# Altium schematic sheet sch-pi-radio-bonnet.SchDoc
size A4
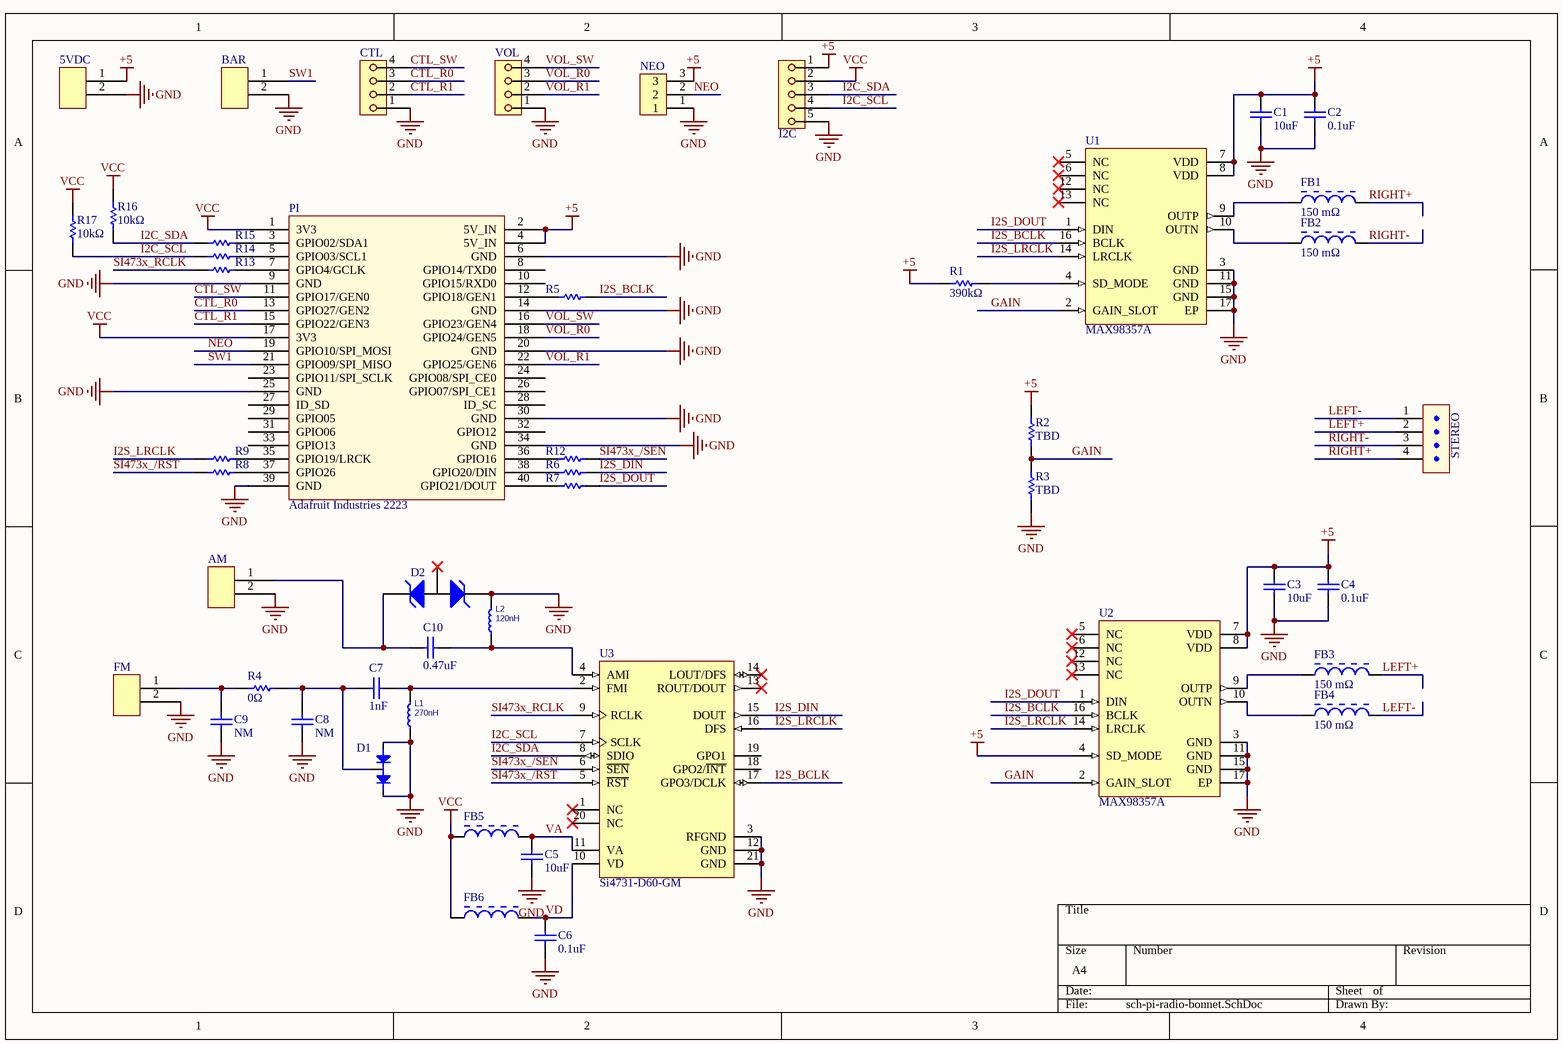
[diagram p0: sch-pi-radio-bonnet.SchDoc]

## Parts
5VDC  Barrette 2p  [PCB-ayp4uy6mce3kuznu7cpv-1]  (value not drawn)
AM  Barrette 2p  [PCB-ayp4uy6mce3kuznu7cpv-1]  (value not drawn)
BAR  Barrette 2p  [PCB-ayp4uy6mce3kuznu7cpv-1]  (value not drawn)
C1  10uF  [PCB-omhpi3dp2pmtm0tjiw77-1]
C2  0.1uF  [PCB-clu7e9t765a29ce8du29-1]
C3  10uF  [PCB-omhpi3dp2pmtm0tjiw77-1]
C4  0.1uF  [PCB-clu7e9t765a29ce8du29-1]
C5  10uF  [PCB-omhpi3dp2pmtm0tjiw77-1]
C6  0.1uF  [PCB-clu7e9t765a29ce8du29-1]
C7  1nF  [PCB-n0nn8wk56cuuomqd6cni-1]
C8  NM  [PCB-n0nn8wk56cuuomqd6cni-1]
C9  NM  [PCB-n0nn8wk56cuuomqd6cni-1]
C10  0.47uF  [PCB-7meup49cu6qw2zbjtc97-1]
CTL  Molex 90120-0764  [PCB-mruwntkvy73mrw75dg9m-1]  (value not drawn)
D1  BAV99LT1G  [ONSC-SOT-23-3-318-08_V]  (value not drawn)
D2  CM1214A-01SO  [ONSC-SOT-23-3-318-08_V]  (value not drawn)
FB1  150 mΩ  [MMZ1608B121C]
FB2  150 mΩ  [MMZ1608B121C]
FB3  150 mΩ  [MMZ1608B121C]
FB4  150 mΩ  [MMZ1608B121C]
FB5  BLM18BB331SN1D  [MURA-BLM18-RF-H4-CHIP-2_V]  (value not drawn)
FB6  BLM18BB331SN1D  [MURA-BLM18-RF-H4-CHIP-2_V]  (value not drawn)
FM  Barrette 2p  [PCB-ayp4uy6mce3kuznu7cpv-1]  (value not drawn)
I2C  Molex 90120-0765  [PCB-t56pkikz1yynik2i2jge-1]  (value not drawn)
L1  270nH  [PCB-2aq0h2ab72d503fsqzz9-1]
L2  120nH  [PCB-2aq0h2ab72d503fsqzz9-1]
NEO  TE Connectivity / AMP 4-103321-5  [PCB-xi9jnxfk0tsn3lp09zze-1]  (value not drawn)
PI  Adafruit Industries 2223  [PCB-dv9vmhrfa2chsb9gidwm-1]
R1  390kΩ  [PCB-cvo6ml1wdjffqaw6a973-1]
R2  TBD  [RESC1609X55X30LL10T20]
R3  TBD  [RESC1609X55X30LL10T20]
R4  0Ω  [RESC1609X55X30LL10T20]
R5  0Ω  [RESC1608X55X25LL10T15]  (value not drawn)
R6  0Ω  [RESC1608X55X25LL10T15]  (value not drawn)
R7  0Ω  [RESC1608X55X25LL10T15]  (value not drawn)
R8  0Ω  [RESC1608X55X25LL10T15]  (value not drawn)
R9  0Ω  [RESC1608X55X25LL10T15]  (value not drawn)
R12  0Ω  [RESC1608X55X25LL10T15]  (value not drawn)
R13  0Ω  [RESC1608X55X25LL10T15]  (value not drawn)
R14  0Ω  [RESC1608X55X25LL10T15]  (value not drawn)
R15  0Ω  [RESC1608X55X25LL10T15]  (value not drawn)
R16  10kΩ  [RESC1609X55X30LL10T20]
R17  10kΩ  [RESC1609X55X30LL10T20]
STEREO  B4B-PH-K-S(LF)(SN)  [PCB-nfo1v6t1kar7doke0b73-1]  (value not drawn)
U1  MAX98357A  [MAXM-T1633F+3_Mod]
U2  MAX98357A  [MAXM-T1633F+3_Mod]
U3  Si4731-D60-GM  [SLAB-QFN-20-1700x1700TP_V]
VOL  Molex 90120-0764  [PCB-mruwntkvy73mrw75dg9m-1]  (value not drawn)

## Nets
+5: 5VDC.1 C1.2 C2.2 C3.2 C4.2 I2C.1 NEO.3 PI.2(5V_IN) PI.4(5V_IN) R1.1 R2.1 U1.7(VDD) U1.8(VDD) U2.4(SD_MODE) U2.7(VDD) U2.8(VDD)
GND: 5VDC.2 AM.2 BAR.2 C1.1 C2.1 C3.1 C4.1 C5.1 C6.1 C8.1 C9.1 CTL.1 D1.1(A) D1.2(K) D2.1(CH1) FM.2 I2C.5 L1.1 L2.2 NEO.1 PI.6(GND) PI.9(GND) PI.14(GND) PI.20(GND) PI.25(GND) PI.30(GND) PI.34(GND) PI.39(GND) R3.2 U1.3(GND) U1.11(GND) U1.15(GND) U1.17(EP) U2.3(GND) U2.11(GND) U2.15(GND) U2.17(EP) U3.3(RFGND) U3.12(GND) U3.21(GND) VOL.1
VCC: FB5.1 FB6.1 I2C.2 PI.1(3V3) PI.17(3V3) R16.2 R17.2
CTL_R0: CTL.3 PI.13(GPIO27/GEN2)
CTL_R1: CTL.2 PI.15(GPIO22/GEN3)
CTL_SW: CTL.4 PI.11(GPIO17/GEN0)
GAIN: R2.2 R3.1 U1.2(GAIN_SLOT) U2.2(GAIN_SLOT)
I2C_SCL: I2C.4 R14.2 R17.1 U3.7(SCLK)
I2C_SDA: I2C.3 R15.2 R16.1 U3.8(SDIO)
I2S_BCLK: R5.1 U1.16(BCLK) U2.16(BCLK) U3.17(GPO3/DCLK)
I2S_DIN: R6.1 U3.15(DOUT)
I2S_DOUT: R7.1 U1.1(DIN) U2.1(DIN)
I2S_LRCLK: R9.2 U1.14(LRCLK) U2.14(LRCLK) U3.16(DFS)
LEFT+: FB3.2 STEREO.2
LEFT-: FB4.2 STEREO.1
NEO: NEO.2 PI.19(GPIO10/SPI_MOSI)
RIGHT+: FB1.2 STEREO.4
RIGHT-: FB2.2 STEREO.3
SI473x_/RST: R8.2 U3.5(~{RST})
SI473x_/SEN: R12.1 U3.6(~{SEN})
SI473x_RCLK: R13.2 U3.9(RCLK)
SW1: BAR.1 PI.21(GPIO09/SPI_MISO)
VA: C5.2 FB5.2 U3.11(VA)
VD: C6.2 FB6.2 U3.10(VD)
VOL_R0: PI.18(GPIO24/GEN5) VOL.3
VOL_R1: PI.22(GPIO25/GEN6) VOL.2
VOL_SW: PI.16(GPIO23/GEN4) VOL.4
NetAM_1: AM.1 C10.2 D2.2(CH2)
NetC7_1: C7.1 C8.2 D1.3(K/A) R4.1
NetC7_2: C7.2 L1.2 U3.2(FMI)
NetC9_2: C9.2 FM.1 R4.2
NetC10_1: C10.1 L2.1 U3.4(AMI)
NetFB1_1: FB1.1 U1.9(OUTP)
NetFB2_1: FB2.1 U1.10(OUTN)
NetFB3_1: FB3.1 U2.9(OUTP)
NetFB4_1: FB4.1 U2.10(OUTN)
NetPI_3: PI.3(GPIO02/SDA1) R15.1
NetPI_5: PI.5(GPIO03/SCL1) R14.1
NetPI_7: PI.7(GPIO4/GCLK) R13.1
NetPI_12: PI.12(GPIO18/GEN1) R5.2
NetPI_35: PI.35(GPIO19/LRCK) R9.1
NetPI_36: PI.36(GPIO16) R12.2
NetPI_37: PI.37(GPIO26) R8.1
NetPI_38: PI.38(GPIO20/DIN) R6.2
NetPI_40: PI.40(GPIO21/DOUT) R7.2
NetR1_2: R1.2 U1.4(SD_MODE)

Not connected (* = marked no-connect by the designer): D2 3(NC)*; PI 8(GPIO14/TXD0) 10(GPIO15/RXD0) 23(GPIO11/SPI_SCLK) 24(GPIO08/SPI_CE0) 26(GPIO07/SPI_CE1) 27(ID_SD) 28(ID_SC) 29(GPIO05) 31(GPIO06) 32(GPIO12) 33(GPIO13); U1 5(NC)* 6(NC)* 12(NC)* 13(NC)*; U2 5(NC)* 6(NC)* 12(NC)* 13(NC)*; U3 1(NC)* 13(ROUT/DOUT)* 14(LOUT/DFS)* 18(GPO2/~{INT}) 19(GPO1) 20(NC)*

## Library data of the parts
5VDC AM BAR FM = CMP-db3d12a8237904fa-7: Barrette de 2 contacts; Number of Contacts: 2; OctopartID: db3d12a8237904fa; Octopart URL: http://octopart.com/0022032021-molex-10476834
C1 C3 C5 = CMP-psk8ijhn2x0pc2qt8wxp-2: (MLCC- SMD/SMT) 10UF 25V 10% 0603; CustomComponentID: psk8ijhn2x0pc2qt8wxp
C2 C4 C6 = CMP-15328962-12: 0603 0.1uF Capacitor; Manufacturer Part Number: 0603YC104KAT2A; Insulation Resistance: 1e+11 ?; Voltage Rating (DC): 16.0 V; Lead-Free Status: Lead Free; Dielectric Material: Ceramic Multilayer; Dielectric Characteristic: X7R; Capacitance Tolerance: ±10%; Capacitance: 1e-07 F; OctopartID: 0cd5c6920958d312; Number of Pins: 2; Size-Length: 0.0016002 m; Octopart Url: https://octopart.com/0603yc104kat2a-avx+interconnect+%2F+elco-55386347; Size-Height: 0.00086 m; Case/Package: 0603; REACH SVHC Compliance: No SVHC; RoHS: Compliant; Mounting Style: Surface Mount; Size-Width: 0.0008128 m
C7-C9 = CMP-119140-4: CAP CER 1000PF 50V 10% X7R 0603; Manufacturer Part Number: GCM188R71H102KA37D; Capacitance: 1e-09 F; Lead-Free Status: Lead Free; Voltage Rating (DC): 50.0 V; Capacitance Tolerance: ±10%; Dielectric Characteristic: X7R; Octopart Url: https://octopart.com/gcm188r71h102ka37d-murata-7894790; OctopartID: a08d69fff2ed7f4a; REACH SVHC Compliance: No SVHC; RoHS: Compliant
C10 = CMP-180614-3: CAP CER 0.47UF 10V Y5V 0603; Manufacturer Part Number: 0603ZG474ZAT2A; Capacitance: 4.7e-07 F; Lead-Free Status: Lead Free; Voltage Rating (DC): 10.0 V; Case/Package: 0603; Dielectric Characteristic: Y5V; Mounting Style: Surface Mount; Octopart Url: https://octopart.com/0603zg474zat2a-avx+interconnect+%2F+elco-2666857; OctopartID: cdda04f859d5121d; Packaging: Tape; RoHS: Compliant
CTL VOL = CMP-f5c93cc9d0ed2a0e-7: 2.54mm (.100") Pitch C-Grid III Header, Single Row, Vertical, 3 Circuits, 0.38µm (15µ") Gold (Au) Selective Plating; Glow Wire Compliant: Non-Compliant; Contact Resistance: 20.0 mΩ; Voltage Rating (AC): 350 V; Number of Contacts: 4; Lead-Free Status: Lead Free; Current Rating: 3.00 A; Insulation Resistance: 5.00 GΩ; Number of Circuits: 3; Gender: Male; Orientation: Vertical; Mounting Style: Through Hole, Vertical; Octopart URL: http://octopart.com/90120-0764-molex-655426; Pin Pitch: 2.54 mm; Size-Height: 2.50 mm; Number of Rows: 1; Size-Width: 2.54 mm; Contact Material: Copper; Lifecycle Status: Not Listed by Manufacturer; RoHS: Compliant; Contact Plating: Gold; Halogen Free Status: Not Halogen Free; Housing Material: Plastic; OctopartID: f5c93cc9d0ed2a0e; Packaging: Bag; Voltage Rating (DC): 350 V; Manufacturer Part Number: 90120-0764; Size-Length: 10.2 mm; Housing Color: Black; Number of Positions: 4; Material: Polyester
D1 = CMP-10548246-6: Dual Series Switching Diodes, 3-Pin SOT-23, Pb-Free, Tape and Reel; Forward Voltage: 1.0 V; Voltage Rating (DC): 70.0 V; Current Rating: 0.2 A; Capacitance: 1.5e-12 F; Lead-Free Status: Lead Free; Octopart Url: https://octopart.com/bav99lt1g-on+semiconductor-55396102; RoHS: Compliant; OctopartID: b3e779a0d1876c20; Halogen Free Status: Halogen Free; Lifecycle Status: Active; Number of Pins: 3; Manufacturer Part Number: BAV99LT1G; REACH SVHC Compliance: No SVHC; Mounting Style: Surface Mount; Case/Package: SOT-23
D2 = CMP-296429-3: 1-Channel PicoGuard(R) AC Signal ESD Protector, 3-Pin SOT-23, Pb-Free, Tape and Reel; Lead-Free Status: Lead Free; Operating Voltage: 7.0 V; Manufacturer Part Number: CM1214A-01SO; Case/Package: SOT-23-3; Halogen Free Status: Halogen Free; Lifecycle Status: Active; Number of Pins: 3; Octopart Url: https://octopart.com/cm1214a-01so-on+semiconductor-18688094; OctopartID: 8880409785b85747; REACH SVHC Compliance: No SVHC; RoHS: Compliant
FB1-FB4 = CMP-4bc182cef0259406-4: MMZ Series 0603 120 Ohm 600 mA 0.15 Ohm DCR Surface Mount Signal Line Chip Bead; Frequency: 100 MHz; Shielding: No; Case/Package (SI): 1608; Current Rating: 600 mA; Resistance: 150 m?; Lead-Free Status: Lead Free; RoHS: Compliant; Size-Width: 800 µm; OctopartID: 4bc182cef0259406; Octopart URL: http://octopart.com/mmz1608b121c-tdk-368258; Number of Pins: 2; Size-Height: 600 µm; Mounting Style: Surface Mount; Size-Length: 1.60 mm; Manufacturer Part Number: MMZ1608B121C; Packaging: Cut Tape (CT), Tape & Reel (TR); REACH SVHC Compliance: No SVHC; Case/Package: 0603
FB5 FB6 = CMP-886571-4: Chip Ferrite Bead for High-speed Signal Lines, 330 Ohm, 400 mA, -55 to 125 degC, 1.6 x 0.8 x 0.95 mm SMD, Tape and Reel; Lead-Free Status: Lead Free; Number of Circuits: 1; Resistance: 330.0 ?; Shielding: No; Case/Package: 0603; Mounting Style: Surface Mount; Octopart Url: https://octopart.com/blm18bb331sn1d-murata-755194; OctopartID: 9e9e579f3e024159; Packaging: Reel; RoHS: Compliant; Size-Length: 0.0016 m; Size-Width: 0.0008 m; Manufacturer Part Number: BLM18BB331SN1D
I2C = CMP-c1590859e47b1e9e-7: 2.54mm (.100") Pitch C-Grid III Header, Single Row, Vertical, 4 Circuits, 0.38µm (15µ") Gold (Au) Selective Plating; Lead-Free Status: Lead Free; Number of Contacts: 5; Current Rating: 3.00 A; Voltage Rating (DC): 350 V; Number of Circuits: 4; Gender: Male; Glow Wire Compliant: Non-Compliant; Pin Pitch: 2.54 mm; Housing Material: Polyester; Halogen Free Status: Not Halogen Free; Mounting Style: Through Hole, Vertical; Orientation: Vertical; Size-Width: 2.54 mm; Lifecycle Status: Not Listed by Manufacturer; Manufacturer Part Number: 90120-0765; Contact Material: Brass; Packaging: Bag; Color: Black; Number of Positions: 5; Housing Color: Black; OctopartID: c1590859e47b1e9e; Size-Length: 12.7 mm; Number of Rows: 1; Size-Height: 2.50 mm; RoHS: Compliant; Octopart URL: http://octopart.com/90120-0765-molex-655428; Contact Plating: Gold
L1 L2 = CMP-e3972a982f6f3c50-2: Inductor RF Chip Wirewound 270nH 5% 100MHz 30Q-Factor 110mA 3.4Ohm DCR 0603 Paper T/R; Manufacturer Part Number: LQW18ANR27J00D; Self Resonant Frequency: 960 MHz; Shielding: No; Case/Package (SI): 1608; Lead-Free Status: Lead Free; Lifecycle Status: Active; Size-Height: 800 µm; Mounting Style: Surface Mount; Size-Width: 800 µm; Octopart URL: https://octopart.com/lqw18anr27j00d-murata-387486; Inductance: 270 nH; RoHS: Compliant; OctopartID: e3972a982f6f3c50; Size-Length: 1.60 mm; Operating Temperature: 85.0 °C (max); Case/Package: 1608, 0603
NEO = CMP-5821934eb82787e6-1: Conn Unshrouded Header HDR 3 POS 2.54mm Solder ST Thru-Hole; ELV Compliant: Compliant; Mounting Style: PCB; RoHS: Compliant; Housing Color: Black; OctopartID: 5821934eb82787e6; Flammability Rating: UL 94 V-0; Contact Material: Phosphor Bronze; Octopart URL: http://octopart.com/4-103321-5-te+connectivity+%2F+amp-40224096; Contact Plating: Tin, Tin over Nickel; Housing Material: Thermoplastic; Lifecycle Status: Active; Orientation: Vertical; Manufacturer Part Number: 4-103321-5
PI = CMP-4e918466a73d9156-23: GPIO Stacking Header for Pi A+/B+/Pi 2/Pi 3 - Extra-long 2x20 Pins
R1 = CMP-0d33c148b8fcd2f4-2: SMD (0603) 390K ohm 0.5% 0.33W AEC-Q200; Manufacturer Part Number: SG73G1JTTD3903D; Octopart URL: https://octopart.com/sg73g1jttd3903d-koa+speer-91328681; OctopartID: 0d33c148b8fcd2f4
R2-R4 R16 R17 = CMP-3717982-3: Thin Film Resistors - SMD 10Kohms .5% 25ppm; Manufacturer Part Number: TNPW060310K0DEEA; Lead-Free Status: Lead Free; Power Rating: 0.1 W; Resistance: 10000.0 ?; Resistance Tolerance: ±0.5%; Voltage Rating (DC): 75.0 V; Case/Package: 0603; Number of Pins: 2; Octopart Url: https://octopart.com/tnpw060310k0deea-vishay-42337064; OctopartID: d1ee1a62f7a00e29; Packaging: Tape & Reel (TR); RoHS: Compliant
R5-R9 R12-R15 = CMP-3759259-5: YAGEO   RC0603JR-100RL   THICK FILM RESISTOR, 0 OHM, 100mW, 5%; Voltage Rating (DC): 50.0 V; Resistance: 0.0 ?; Lead-Free Status: Lead Free; Power Rating: 0.1 W; OctopartID: 6faba662d6acb06c; Size-Length: 0.0016 m; Octopart Url: https://octopart.com/rc0603jr-100rl-yageo-12819553; Mounting Style: Surface Mount; Resistance Tolerance: ±5%; RoHS: Compliant; Case/Package: 0603; Manufacturer Part Number: RC0603JR-100RL; Packaging: Cut Tape (CT); Number of Pins: 2
STEREO = CMP-642981-21: PH Series 4 Position 2 mm Pitch Through Hole Crimp Top Entry Shrouded Header
U1 U2 = CMP-c84a034571e2178d-1: Audio Amp Speaker 1-CH Mono Class-D 16-Pin TQFN EP; Lifecycle Status: Not Listed by Manufacturer
U3 = CMP-2112149-3: Broadcast AM / FM / SW / LW Radio Receiver, -20 to 85 degC, 20-pin QFN, Tray; Manufacturer Part Number: SI4731-D60-GM; Octopart Url: https://octopart.com/si4731-d60-gm-silicon+labs-19668702; OctopartID: ad9c65ba9624725b; RoHS: Compliant